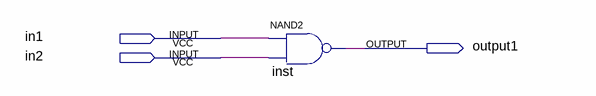
[diagram p0: schematic sheet]
// Quartus schematic GateDemo.bdf as structural Verilog: 1 symbols, 3 pins
module GateDemo (
  input  in1,
  input  in2,
  output output1
);

  nand inst (output1, in1, in2);
endmodule
